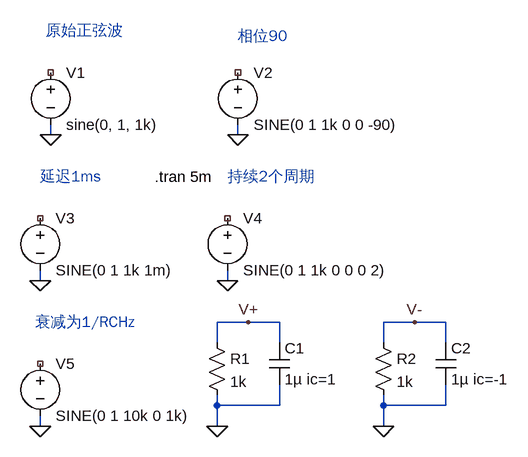
[diagram p0: schematic Draft1.asc]
* Draft1.asc
V1 NC_01 0 sine(0, 1, 1k)
V2 NC_02 0 SINE(0 1 1k 0 0 -90)
V3 NC_03 0 SINE(0 1 1k 1m)
V4 NC_04 0 SINE(0 1 1k 0 0 0 2)
V5 NC_05 0 SINE(0 1 10k 0 1k)
R1 V+ 0 1k
C1 V+ 0 1µ ic=1
R2 V- 0 1k
C2 V- 0 1µ ic=-1
* 原始正弦波
.tran 5m
* 相位90
* 延迟1ms
* 持续2个周期
* 衰减为1/RCHz
.backanno
.end

* Results of the author's LTspice run, read from the files saved beside the schematic
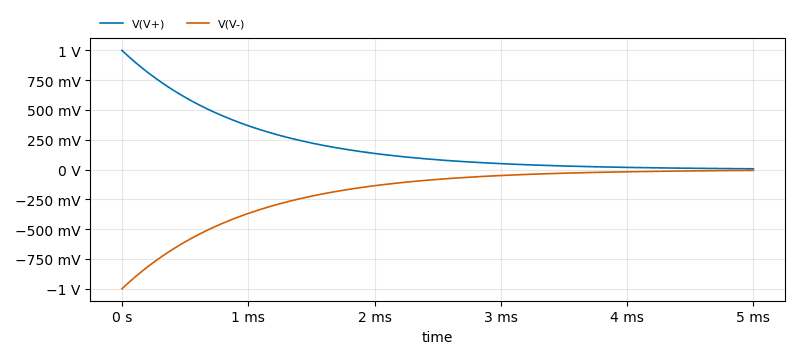
[diagram p1: Transient Analysis of Draft1.asc, plotted from the saved traces]
* Transient Analysis, 1 run:
*   V(V+): min 6.738 mV, max 1 V, average 198.7 mV, rms 316.2 mV, last 6.738 mV
*   V(V-): min -1 V, max -6.738 mV, average -198.7 mV, rms 316.2 mV, last -6.738 mV